# EAGLE schematic VMEMega (EAGLE 6.5.0)

## Sheet 1 of 3
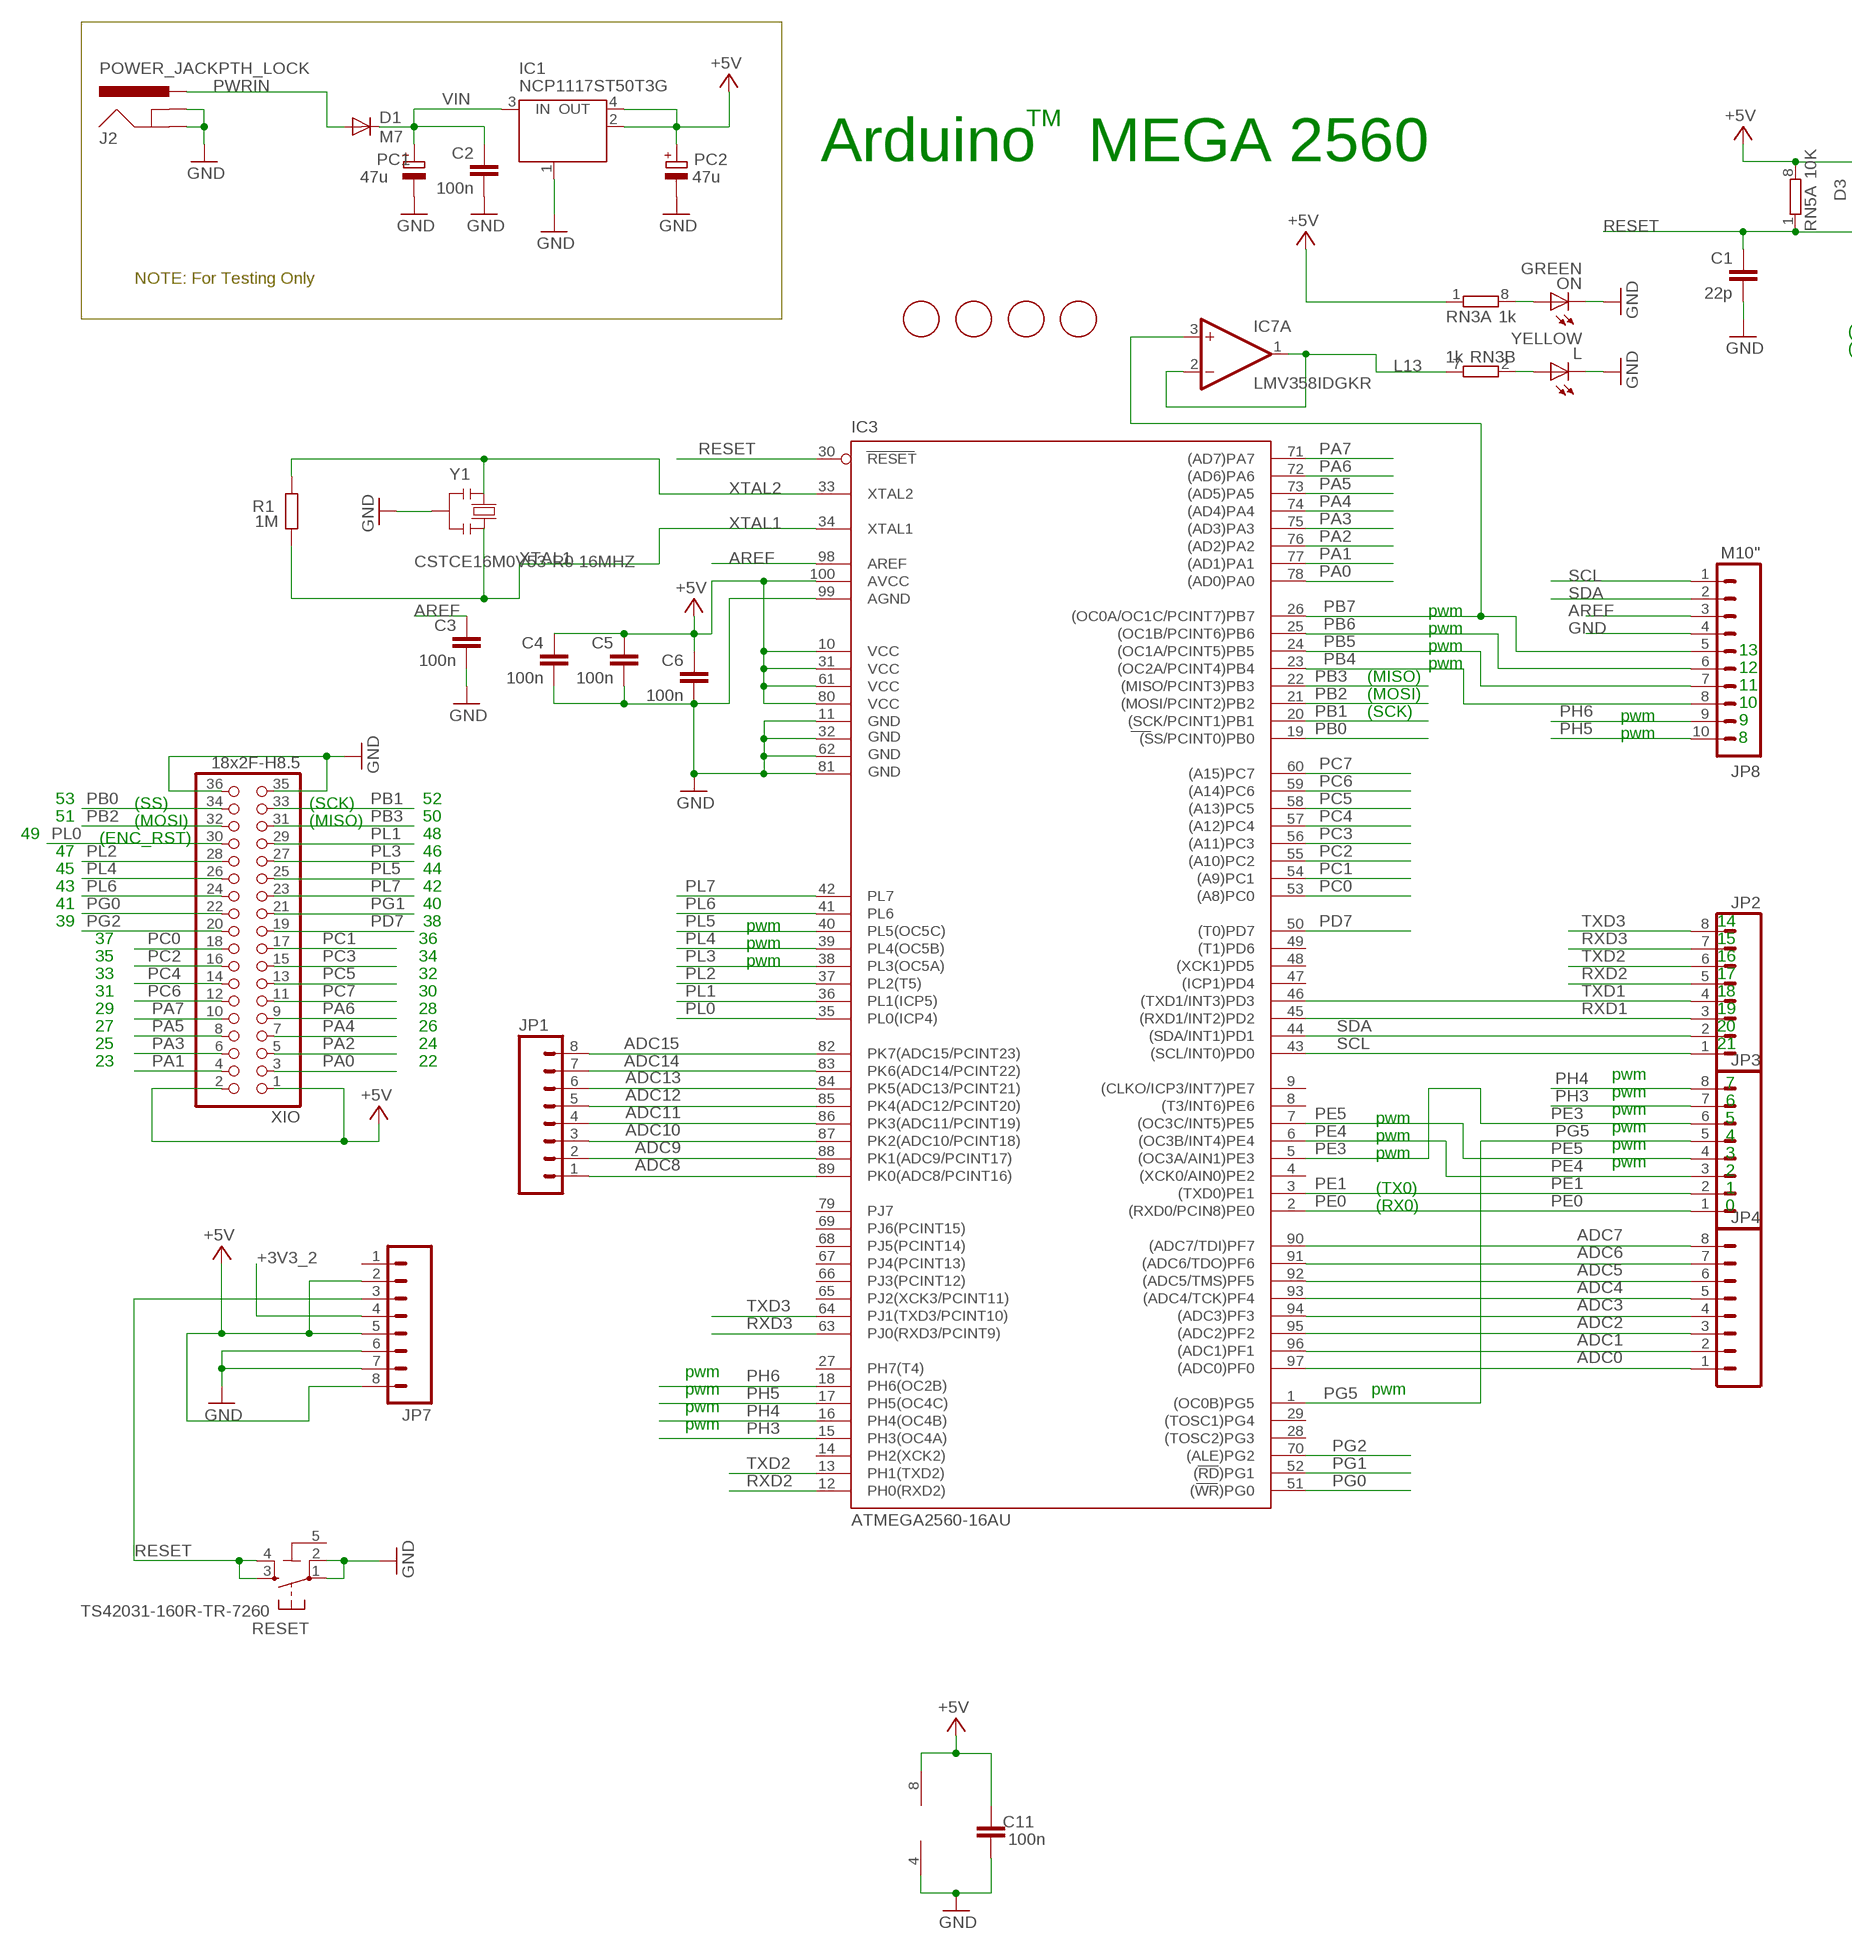
[diagram p0: schematic, sheet 1, part 1 of 2]
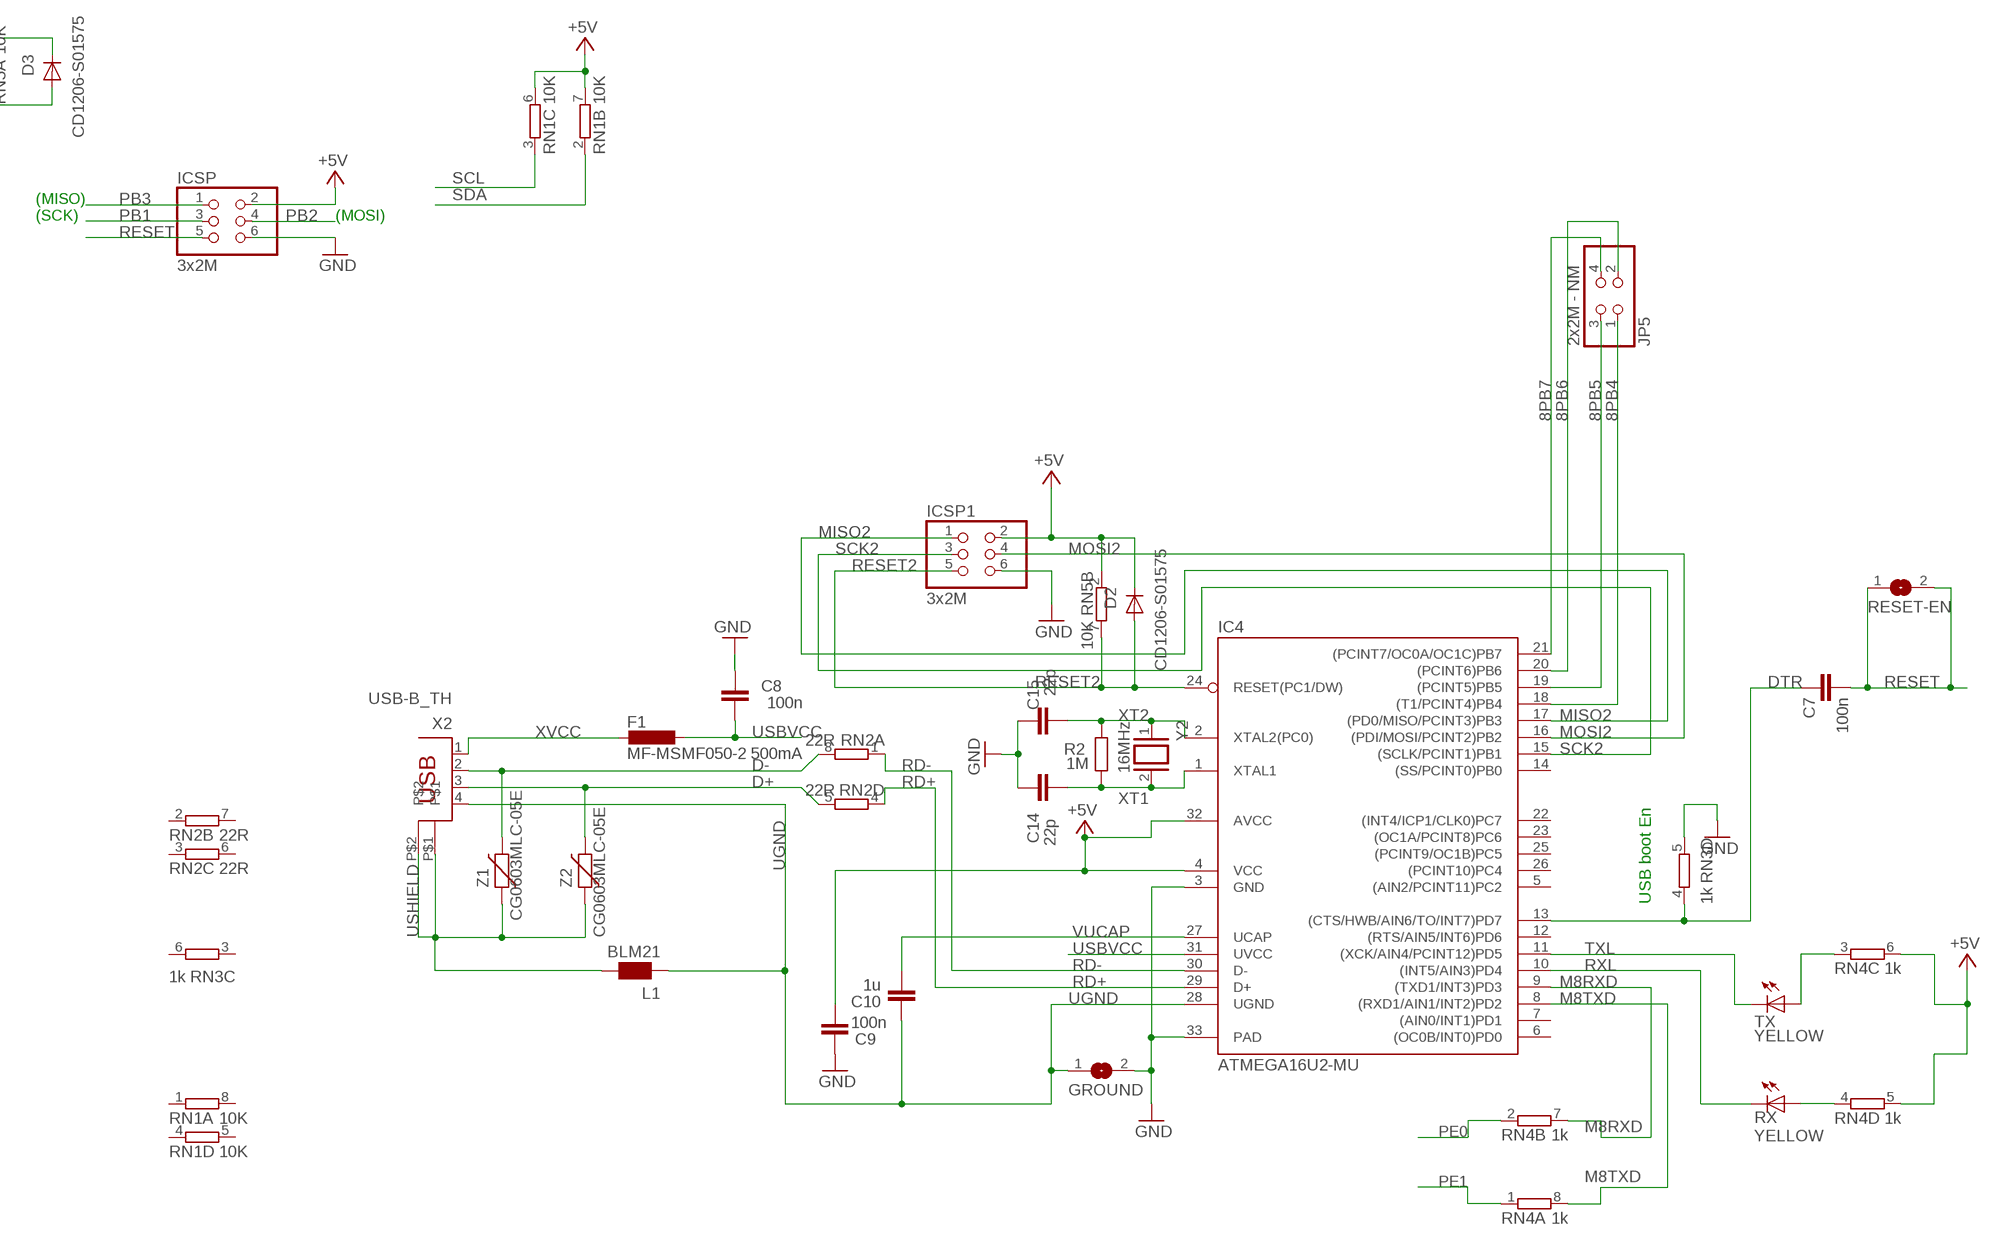
[diagram p1: schematic, sheet 1, part 2 of 2]

### Parts
C1  22p  C-EU0603-RND  [C0603-ROUND]
C2  100n  C-EU0603-RND  [C0603-ROUND]
C3  100n  C-EU0603-RND  [C0603-ROUND]
C4  100n  C-EU0603-RND  [C0603-ROUND]
C5  100n  C-EU0603-RND  [C0603-ROUND]
C6  100n  C-EU0603-RND  [C0603-ROUND]
C7  100n  C-EU0603-RND  [C0603-ROUND]
C8  100n  C-EU0603-RND  [C0603-ROUND]
C9  100n  C-EU0603-RND  [C0603-ROUND]
C10  1u  C-EU0603-RND  [C0603-ROUND]
C11  100n  C-EU0603-RND  [C0603-ROUND]
C14  22p  C-EU0603-RND  [C0603-ROUND]
C15  22p  C-EU0603-RND  [C0603-ROUND]
D1  M7  DIODE-SMB  [SMB]
D2  CD1206-S01575  DIODE-MINIMELF  [MINIMELF]
D3  CD1206-S01575  DIODE-MINIMELF  [MINIMELF]
F1  MF-MSMF050-2 500mA  L-EUL1812  [L1812]
FD1  FIDUCIALMOUNT  [FIDUCIA-MOUNT]
FD2  FIDUCIALMOUNT  [FIDUCIA-MOUNT]
FD3  FIDUCIALMOUNT  [FIDUCIA-MOUNT]
FD4  FIDUCIALMOUNT  [FIDUCIA-MOUNT]
GROUND  SJ  [SJ]
IC1  NCP1117ST50T3G  MC33269ST-3.3T3  [SOT223]
IC3  ATMEGA2560-16AU  ATMEGA25602560-16AU  [TQFP100]
IC4  ATMEGA16U2-MU  [MLF32]
IC7  LMV358IDGKR  LMV358MMX  [MSOP08]
ICSP  3x2M  PINHD-2X3  [2X03]
ICSP1  3x2M  PINHD-2X3  [2X03]
J2  POWER_JACKPTH_LOCK  [POWER_JACK_PTH_LOCK]
JP1  M081X08  [1X08]
JP2  M081X08  [1X08]
JP3  M081X08  [1X08]
JP4  M081X08  [1X08]
JP5  2x2M - NM  PINHD-2X2  [2X02]
JP7  M081X08  [1X08]
JP8  M10"  [1X10]
L  YELLOW  LEDCHIP-LED0805  [CHIP-LED0805]
L1  BLM21  WE-CBF_0805  [0805]
ON  GREEN  LEDCHIP-LED0805  [CHIP-LED0805]
PC1  47u  CPOL-EUD  [PANASONIC_D]
PC2  47u  CPOL-EUD  [PANASONIC_D]
R1  1M  R-EU_R0603  [R0603-ROUND]
R2  1M  R-EU_R0603  [R0603-ROUND]
RESET  TS42031-160R-TR-7260  TS42  [TS42]
RESET-EN  SJ  [SJ]
RN1  10K  4R-NCAT16  [CAT16]
RN2  22R  4R-NCAY16  [CAY16]
RN3  1k  4R-NCAY16  [CAY16]
RN4  1k  4R-NCAY16  [CAY16]
RN5  10K  4R-NCAT16  [CAT16]
RX  YELLOW  LEDCHIP-LED0805  [CHIP-LED0805]
TX  YELLOW  LEDCHIP-LED0805  [CHIP-LED0805]
X2  USB-B_TH  PN61729  [PN61729]
XIO  18x2F-H8.5  PINHD-2X18  [2X18]
Y1  CSTCE16M0V53-R0 16MHZ  RESONATORMU  [RESONATOR]
Y2  16MHz  XTAL/S  [QS]
Z1  CG0603MLC-05E  VARISTORCN0603  [CT/CN0603]
Z2  CG0603MLC-05E  VARISTORCN0603  [CT/CN0603]

### Nets
8PB4: IC4.18((T1/PCINT4)PB4) JP5.1
8PB5: IC4.19((PCINT5)PB5) JP5.3
8PB6: IC4.20((PCINT6)PB6) JP5.2
8PB7: IC4.21((PCINT7/OC0A/OC1C)PB7) JP5.4
+3V3_2 [power]: JP7.4 ; also sheet 2
+5V [power usb]: C4.1 C5.1 C6.1 C9.1 C11.2 D2.C D3.C IC1.2(OUT) IC1.4(OUT) IC3.10(VCC) IC3.31(VCC1) IC3.61(VCC2) IC3.80(VCC3) IC3.100(AVCC) IC4.4(VCC) IC4.32(AVCC) IC7.8(P:V+) ICSP1.2 ICSP.2 JP7.2 JP7.5 JP7.8 PC2.+ RN1.6 RN1.7 RN3.1 RN4.5 RN4.6 RN5.2 RN5.8 XIO.1 XIO.2 ; also sheet 2,3
ADC0: IC3.97((ADC0)PF0) JP4.1
ADC1: IC3.96((ADC1)PF1) JP4.2
ADC2: IC3.95((ADC2)PF2) JP4.3
ADC3: IC3.94((ADC3)PF3) JP4.4
ADC4: IC3.93((ADC4/TCK)PF4) JP4.5
ADC5: IC3.92((ADC5/TMS)PF5) JP4.6
ADC6: IC3.91((ADC6/TDO)PF6) JP4.7
ADC7: IC3.90((ADC7/TDI)PF7) JP4.8
ADC8: IC3.89(PK0(ADC8/PCINT16)) JP1.1
ADC9: IC3.88(PK1(ADC9/PCINT17)) JP1.2
ADC10: IC3.87(PK2(ADC10/PCINT18)) JP1.3
ADC11: IC3.86(PK3(ADC11/PCINT19)) JP1.4
ADC12: IC3.85(PK4(ADC12/PCINT20)) JP1.5
ADC13: IC3.84(PK5(ADC13/PCINT21)) JP1.6
ADC14: IC3.83(PK6(ADC14/PCINT22)) JP1.7
ADC15: IC3.82(PK7(ADC15/PCINT23)) JP1.8
AREF: C3.1 IC3.98(AREF) JP8.3 ; also sheet 2
D+: RN2.5 X2.3 Z2.2
D-: RN2.8 X2.2 Z1.2
DTR: C7.1 IC4.13((CTS/HWB/AIN6/TO/INT7)PD7) RN3.4
GND [gnd]: C1.2 C2.2 C3.2 C4.2 C5.2 C6.2 C8.2 C9.2 C11.1 C14.2 C15.2 GROUND.2 IC1.1(GND/ADJ) IC3.11(GND) IC3.32(GND1) IC3.62(GND2) IC3.81(GND3) IC3.99(AGND) IC4.3(GND) IC4.33(PAD) IC7.4(P:V-) ICSP1.6 ICSP.6 J2.GND J2.GNDBREAK JP7.6 JP7.7 JP8.4 L.C ON.C PC1.- PC2.- RESET.1 RESET.2 RN3.5 XIO.35 XIO.36 Y1.2 ; also sheet 2,3
L13: IC7.1(A:OUT) IC7.2(A:-IN) RN3.7
M8RXD: IC4.9((TXD1/INT3)PD3) RN4.7
M8TXD: IC4.8((RXD1/AIN1/INT2)PD2) RN4.8
MISO2: IC4.17((PD0/MISO/PCINT3)PB3) ICSP1.1
MOSI2: IC4.16((PDI/MOSI/PCINT2)PB2) ICSP1.4
N$2: L.A RN3.2
N$3: ON.A RN3.8
N$54: RN4.4 RX.A
N$55: RN4.3 TX.A
PA0: IC3.78((AD0)PA0) XIO.3
PA1: IC3.77((AD1)PA1) XIO.4
PA2: IC3.76((AD2)PA2) XIO.5
PA3: IC3.75((AD3)PA3) XIO.6
PA4: IC3.74((AD4)PA4) XIO.7
PA5: IC3.73((AD5)PA5) XIO.8
PA6: IC3.72((AD6)PA6) XIO.9
PA7: IC3.71((AD7)PA7) XIO.10
PB0: IC3.19((SS/PCINT0)PB0) XIO.34 ; also sheet 3
PB1: IC3.20((SCK/PCINT1)PB1) ICSP.3 XIO.33 ; also sheet 3
PB2: IC3.21((MOSI/PCINT2)PB2) ICSP.4 XIO.32 ; also sheet 3
PB3: IC3.22((MISO/PCINT3)PB3) ICSP.1 XIO.31 ; also sheet 3
PB4: IC3.23((OC2A/PCINT4)PB4) JP8.8
PB5: IC3.24((OC1A/PCINT5)PB5) JP8.7
PB6: IC3.25((OC1B/PCINT6)PB6) JP8.6
PB7: IC3.26((OC0A/OC1C/PCINT7)PB7) IC7.3(A:+IN) JP8.5
PC0: IC3.53((A8)PC0) XIO.18
PC1: IC3.54((A9)PC1) XIO.17
PC2: IC3.55((A10)PC2) XIO.16
PC3: IC3.56((A11)PC3) XIO.15
PC4: IC3.57((A12)PC4) XIO.14
PC5: IC3.58((A13)PC5) XIO.13
PC6: IC3.59((A14)PC6) XIO.12
PC7: IC3.60((A15)PC7) XIO.11
PD7: IC3.50((T0)PD7) XIO.19
PE0: IC3.2((RXD0/PCIN8)PE0) JP3.1 RN4.2
PE1: IC3.3((TXD0)PE1) JP3.2 RN4.1
PE3: IC3.5((OC3A/AIN1)PE3) JP3.6
PE4: IC3.6((OC3B/INT4)PE4) JP3.3
PE5: IC3.7((OC3C/INT5)PE5) JP3.4
PG0: IC3.51((WR)PG0) XIO.22
PG1: IC3.52((RD)PG1) XIO.21
PG2: IC3.70((ALE)PG2) XIO.20
PG5: IC3.1((OC0B)PG5) JP3.5
PH3: IC3.15(PH3(OC4A)) JP3.7
PH4: IC3.16(PH4(OC4B)) JP3.8
PH5: IC3.17(PH5(OC4C)) JP8.10
PH6: IC3.18(PH6(OC2B)) JP8.9
PL0: IC3.35(PL0(ICP4)) XIO.30 ; also sheet 3
PL1: IC3.36(PL1(ICP5)) XIO.29
PL2: IC3.37(PL2(T5)) XIO.28
PL3: IC3.38(PL3(OC5A)) XIO.27
PL4: IC3.39(PL4(OC5B)) XIO.26
PL5: IC3.40(PL5(OC5C)) XIO.25
PL6: IC3.41(PL6) XIO.24
PL7: IC3.42(PL7) XIO.23
PWRIN [power]: D1.A J2.PWR
RD+: IC4.29(D+) RN2.4
RD-: IC4.30(D-) RN2.1
RESET: C1.1 C7.2 D3.A IC3.30(RESET) ICSP.5 JP7.3 RESET-EN.1 RESET-EN.2 RESET.3 RESET.4 RN5.1
RESET2: D2.A IC4.24(RESET(PC1/DW)) ICSP1.5 RN5.7
RXD1: IC3.45((RXD1/INT2)PD2) JP2.3
RXD2: IC3.12(PH0(RXD2)) JP2.5
RXD3: IC3.63(PJ0(RXD3/PCINT9)) JP2.7
RXL: IC4.10((INT5/AIN3)PD4) RX.C
SCK2: IC4.15((SCLK/PCINT1)PB1) ICSP1.3
SCL: IC3.43((SCL/INT0)PD0) JP2.1 JP8.1 RN1.3 ; also sheet 2
SDA: IC3.44((SDA/INT1)PD1) JP2.2 JP8.2 RN1.2 ; also sheet 2
TXD1: IC3.46((TXD1/INT3)PD3) JP2.4
TXD2: IC3.13(PH1(TXD2)) JP2.6
TXD3: IC3.64(PJ1(TXD3/PCINT10)) JP2.8
TXL: IC4.11((XCK/AIN4/PCINT12)PD5) TX.C
UGND [gnd]: C10.2 GROUND.1 IC4.28(UGND) L1.1 X2.4
USBVCC [power usb]: C8.1 F1.1 IC4.31(UVCC)
USHIELD [gnd]: L1.2 X2.P$1 X2.P$2 Z1.1 Z2.1
VIN [power]: C2.1 D1.C IC1.3(IN) PC1.+
VUCAP: C10.1 IC4.27(UCAP)
XT1: C14.1 IC4.1(XTAL1) R2.1 Y2.2
XT2: C15.1 IC4.2(XTAL2(PC0)) R2.2 Y2.1
XTAL1: IC3.34(XTAL1) R1.1 Y1.3
XTAL2: IC3.33(XTAL2) R1.2 Y1.1
XVCC [power usb]: F1.2 X2.1
Unconnected: IC3.4((XCK0/AIN0)PE2) IC3.8((T3/INT6)PE6) IC3.9((CLKO/ICP3/INT7)PE7) IC3.14(PH2(XCK2)) IC3.27(PH7(T4)) IC3.28((TOSC2)PG3) IC3.29((TOSC1)PG4) IC3.47((ICP1)PD4) IC3.48((XCK1)PD5) IC3.49((T1)PD6) IC3.65(PJ2(XCK3/PCINT11)) IC3.66(PJ3(PCINT12)) IC3.67(PJ4(PCINT13)) IC3.68(PJ5(PCINT14)) IC3.69(PJ6(PCINT15)) IC3.79(PJ7) IC4.5((AIN2/PCINT11)PC2) IC4.6((OC0B/INT0)PD0) IC4.7((AIN0/INT1)PD1) IC4.12((RTS/AIN5/INT6)PD6) IC4.14((SS/PCINT0)PB0) IC4.22((INT4/ICP1/CLK0)PC7) IC4.23((OC1A/PCINT8)PC6) IC4.25((PCINT9/OC1B)PC5) IC4.26((PCINT10)PC4) IC7.5(B:+IN) IC7.6(B:-IN) IC7.7(B:OUT) JP7.1 RN1.1 RN1.4 RN1.5 RN1.8 RN2.2 RN2.3 RN2.6 RN2.7 RN3.3 RN3.6 RN5.3 RN5.4 RN5.5 RN5.6

### Notes on the sheet
- TM
- Arduino   MEGA 2560
- NOTE: For Testing Only
- (MISO)
- (SCK) | (MOSI)
- pwm
- pwm
- pwm | 13
- pwm | 12
- (MISO)
- 11
- (MOSI)
- 10
- (SCK) | pwm
- 9
- pwm | 8
- 53 | (SS) | (SCK) | 52
- 51 | (MOSI) | (MISO) | 50
- 49 | (ENC_RST) | 48
- 47 | 46
- 45 | 44
- 43 | 42
- 41 | 40
- 39 | 38 | pwm | 14
- 37 | 36 | pwm | 15
- 35 | 34 | pwm | 16
- 33 | 32 | 17
- 31 | 30 | 18
- 29 | 28 | 19
- 27 | 26 | 20
- 25 | 24 | 21
- 23 | 22 | USB boot En
- pwm
- 7
- pwm
- 6
- pwm
- pwm | 5
- pwm
- pwm | 4
- pwm
- pwm | 3
- pwm
- 2
- (TX0) | 1
- (RX0) | 0
- pwm
- pwm | pwm
- pwm
- pwm

## Sheet 2 of 3
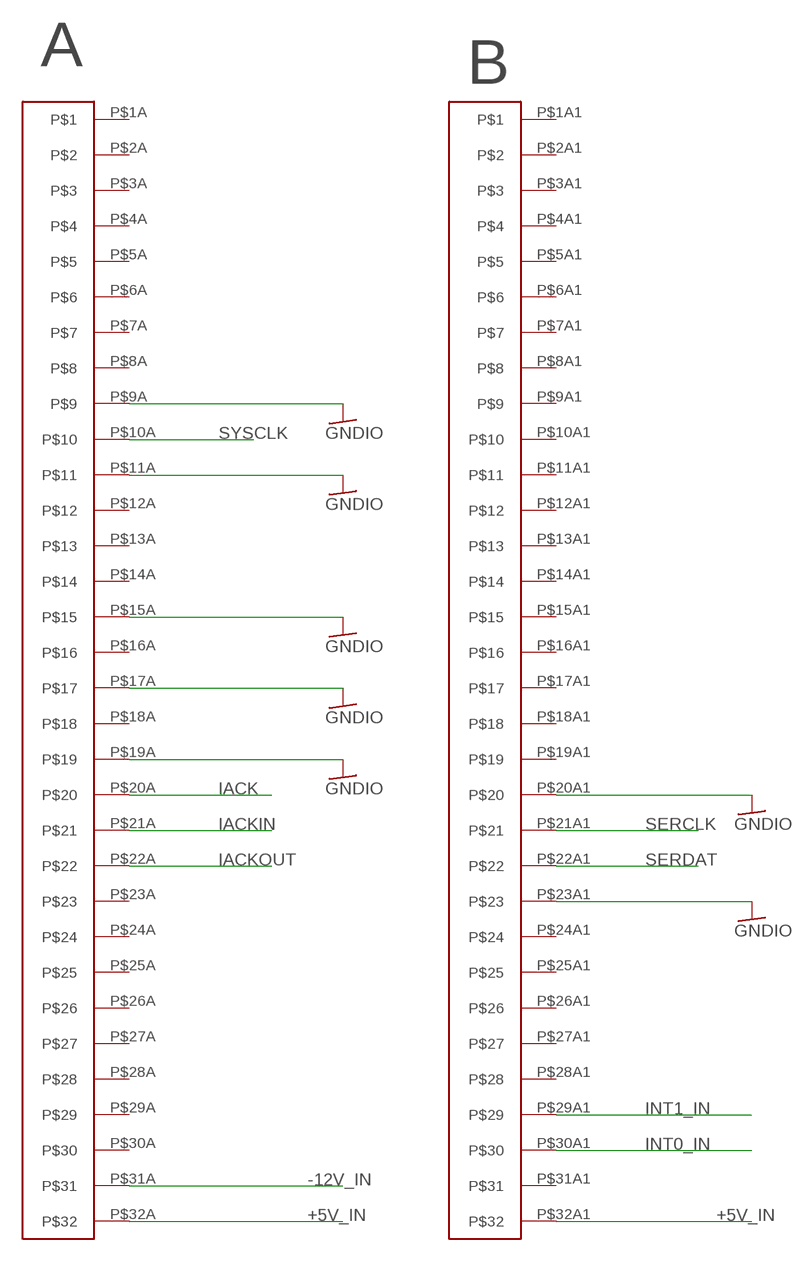
[diagram p2: schematic, sheet 2, part 1 of 2]
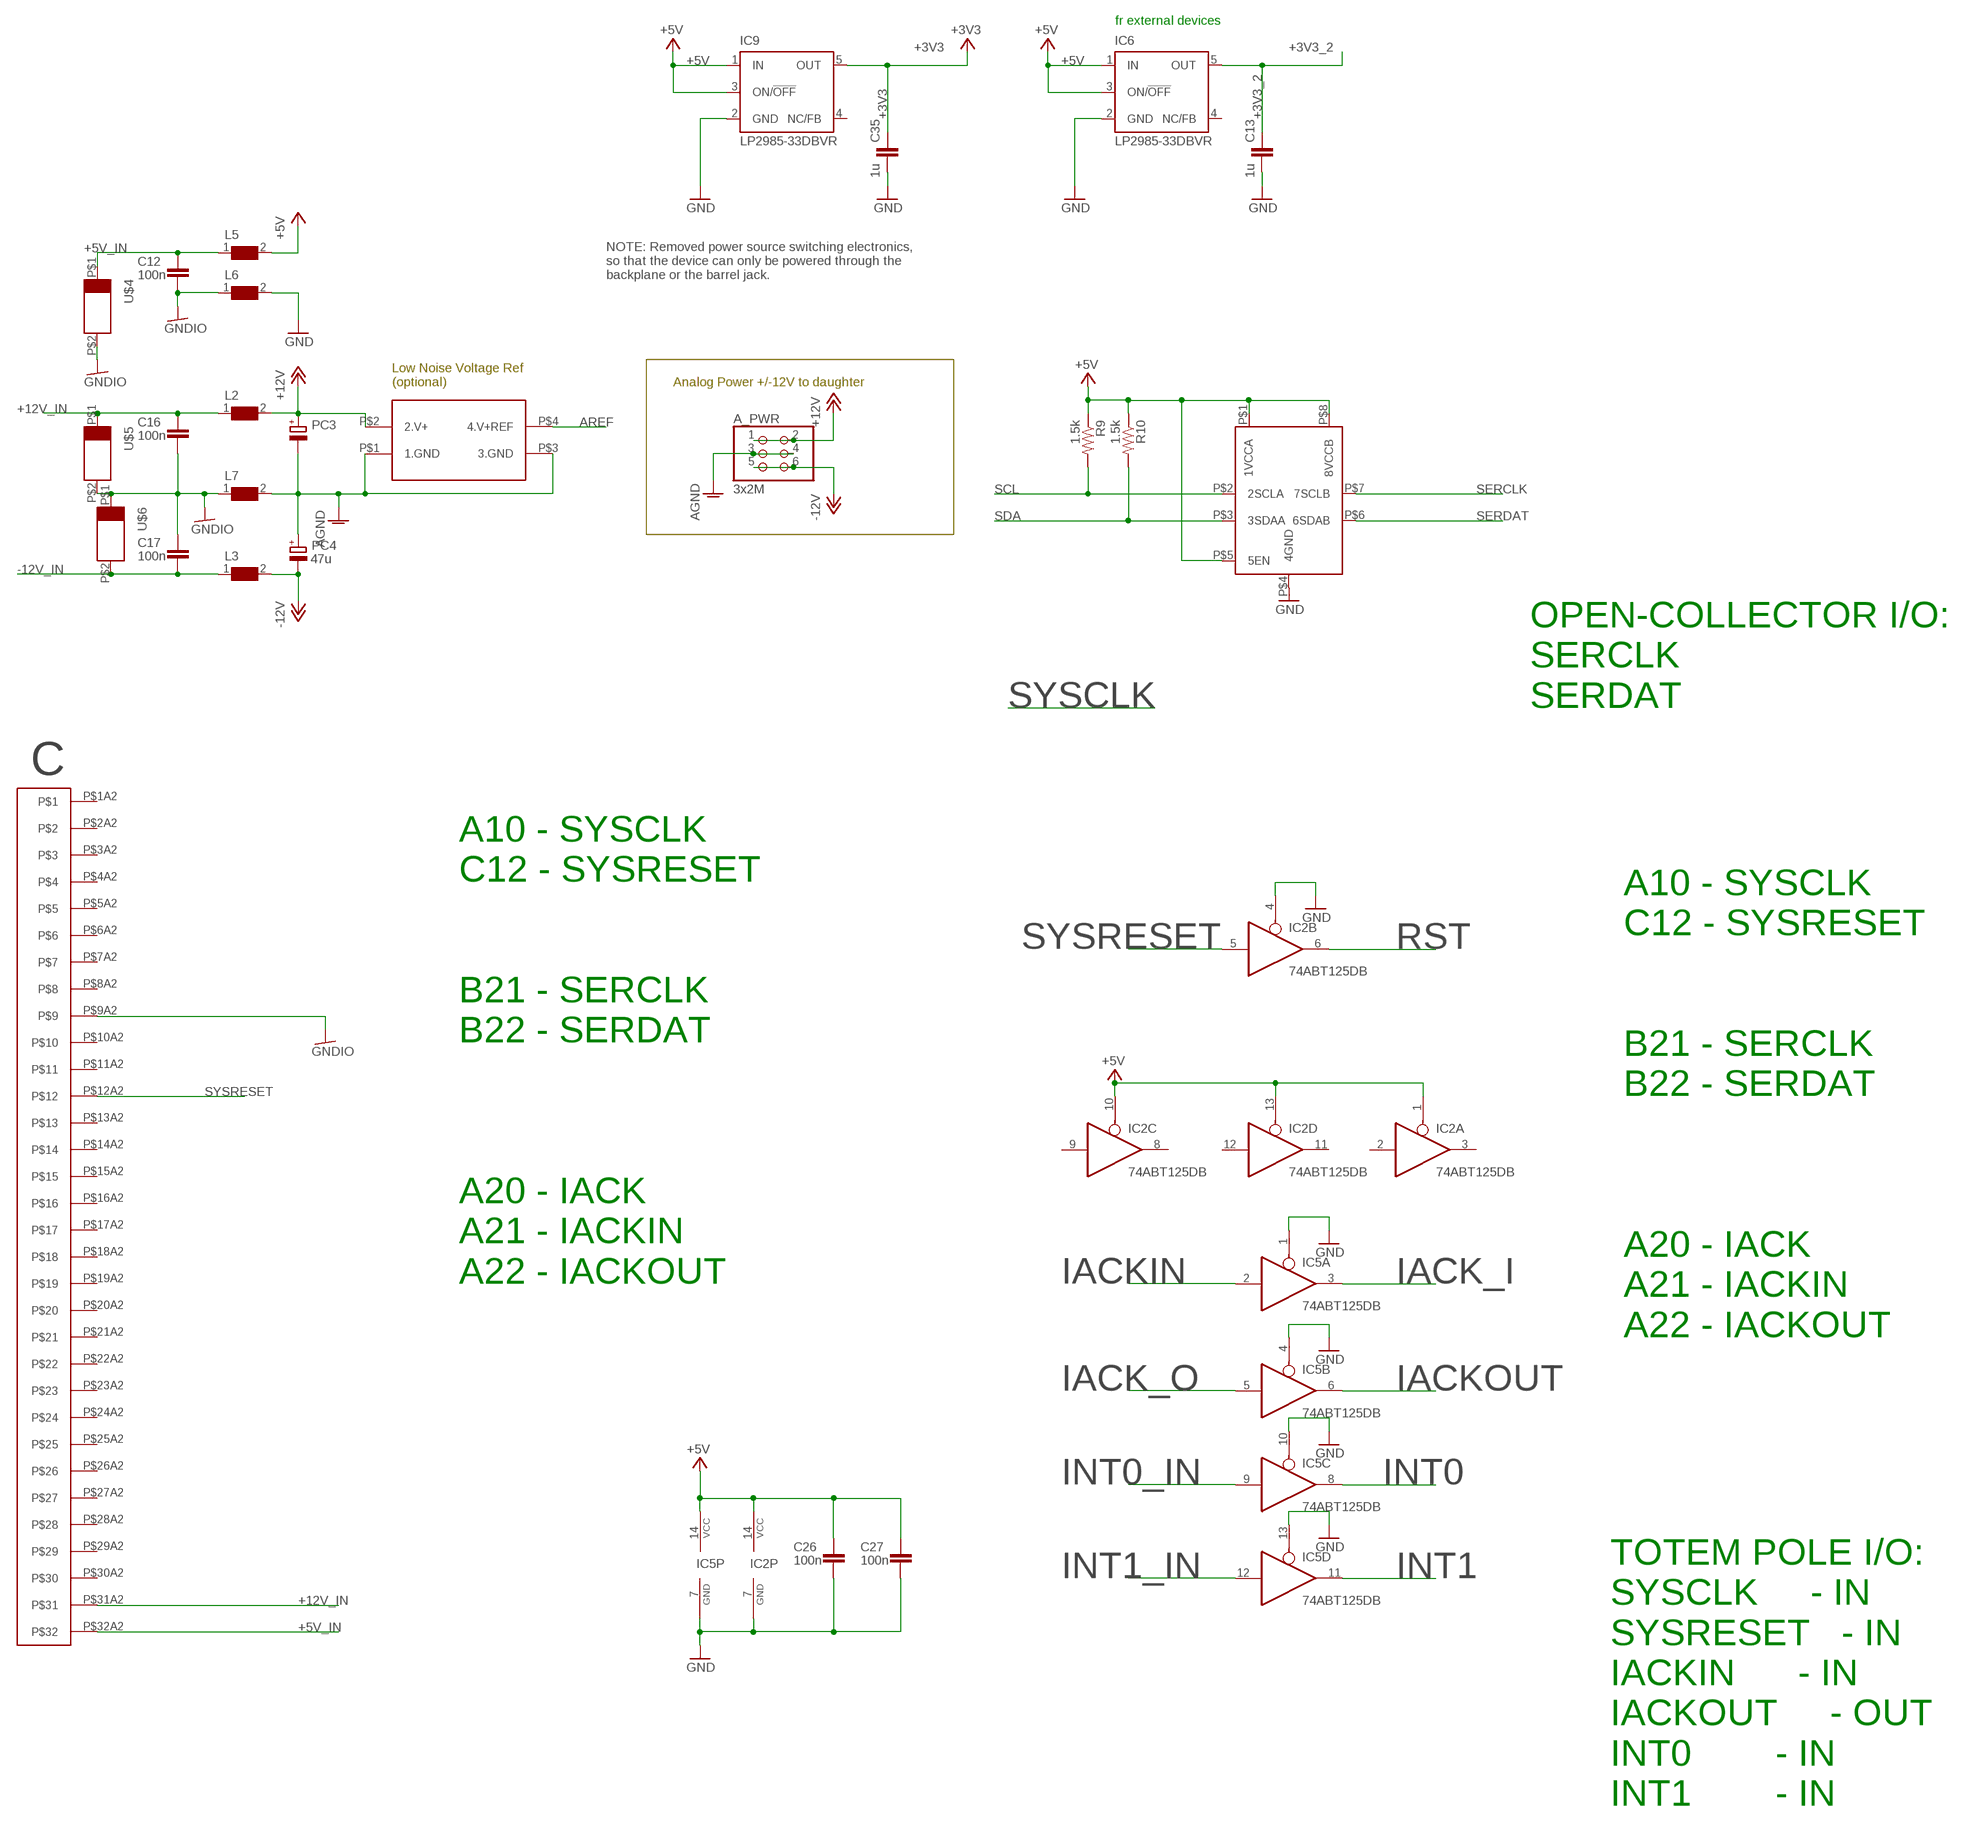
[diagram p3: schematic, sheet 2, part 2 of 2]

### Parts
A_PWR  3x2M  PINHD-2X3  [2X03]
C12  100n  C-EU0603-RND  [C0603-ROUND]
C13  1u  C-EU0603-RND  [C0603-ROUND]
C16  100n  C-EU0603-RND  [C0603-ROUND]
C17  100n  C-EU0603-RND  [C0603-ROUND]
C26  100n  C-EU0603-RND  [C0603-ROUND]
C27  100n  C-EU0603-RND  [C0603-ROUND]
C35  1u  C-EU0603-RND  [C0603-ROUND]
IC2  74ABT125DB  [SSOP14]
IC5  74ABT125DB  [SSOP14]
IC6  LP2985-33DBVR  LP2985-XXDBVR33  [SOT23-DBV]
IC9  LP2985-33DBVR  LP2985-XXDBVR33  [SOT23-DBV]
L2  WE-CBF-7427920_0805  [0805]
L3  WE-CBF-7427920_0805  [0805]
L5  WE-CBF-7427920_0805  [0805]
L6  WE-CBF-7427920_0805  [0805]
L7  WE-CBF-7427920_0805  [0805]
PC3  47u  CPOL-EUD  [PANASONIC_D]
PC4  47u  CPOL-EUD  [PANASONIC_D]
R9  1.5k  R-US_R0603  [R0603]
R10  1.5k  R-US_R0603  [R0603]
U$2  TCA9617A  [TSSOP-8]
U$3  LOWNOISE_VREF_V1B  [LOWNOISE_VREF_V1B]
U$4  SMAJ20A  [D0-214AC]
U$5  SMAJ20A  [D0-214AC]
U$6  SMAJ20A  [D0-214AC]
U$17  DIN_41612_PLUG  [DIN_41612_PLUG]

### Nets
+3V3 [power]: C35.2 IC9.5(OUT) ; also sheet 3
+3V3_2 [power]: C13.2 IC6.5(OUT) ; also sheet 1
+5V [power usb]: C26.2 C27.2 IC2.1(A:OE) IC2.10(C:OE) IC2.13(D:OE) IC2.14(P:VCC) IC5.14(P:VCC) IC6.1(IN) IC6.3(ON/!OFF) IC9.1(IN) IC9.3(ON/!OFF) L5.2 R9.1 R10.1 U$2.P$1(1VCCA) U$2.P$5(5EN) U$2.P$8(8VCCB) ; also sheet 1,3
+5V_IN: C12.2 L5.1 U$4.P$1 U$17.P$32A U$17.P$32A1 U$17.P$32A2
+12V: A_PWR.1 A_PWR.2 L2.2 PC3.+ U$3.P$2(2.V+)
+12V_IN: C16.2 L2.1 U$5.P$1 U$17.P$31A2
-12V: A_PWR.5 A_PWR.6 L3.2 PC4.-
-12V_IN: C17.1 L3.1 U$6.P$2 U$17.P$31A
AGND [gnd]: A_PWR.3 A_PWR.4 L7.2 PC3.- PC4.+ U$3.P$1(1.GND) U$3.P$3(3.GND)
AREF: U$3.P$4(4.V+REF) ; also sheet 1
GND [gnd]: C13.1 C26.1 C27.1 C35.1 IC2.4(B:OE) IC2.7(P:GND) IC5.4(B:OE) IC5.7(P:GND) IC5.10(C:OE) IC5.13(D:OE) IC6.2(GND) IC9.2(GND) L6.2 U$2.P$4(4GND) ; also sheet 1,3
GNDIO [gnd]: C12.1 C16.1 C17.2 L6.1 L7.1 U$4.P$2 U$5.P$2 U$6.P$1 U$17.P$9A U$17.P$9A2 U$17.P$11A U$17.P$15A U$17.P$17A U$17.P$19A U$17.P$20A1 U$17.P$23A1
IACK: U$17.P$20A
IACK_I: IC5.3(A:O)
IACK_O: IC5.5(B:I)
IACKIN: IC5.2(A:I) U$17.P$21A
IACKOUT: IC5.6(B:O) U$17.P$22A
INT0: IC5.8(C:O)
INT0_IN: IC5.9(C:I) U$17.P$30A1
INT1: IC5.11(D:O)
INT1_IN: IC5.12(D:I) U$17.P$29A1
RST: IC2.6(B:O)
SCL: R9.2 U$2.P$2(2SCLA) ; also sheet 1
SDA: R10.2 U$2.P$3(3SDAA) ; also sheet 1
SERCLK: U$2.P$7(7SCLB) U$17.P$21A1
SERDAT: U$2.P$6(6SDAB) U$17.P$22A1
SYSCLK: U$17.P$10A
SYSRESET: IC2.5(B:I) U$17.P$12A2
Unconnected: IC2.2(A:I) IC2.3(A:O) IC2.8(C:O) IC2.9(C:I) IC2.11(D:O) IC2.12(D:I) IC5.1(A:OE) IC6.4(NC/FB) IC9.4(NC/FB) U$17.P$1A U$17.P$1A1 U$17.P$1A2 U$17.P$2A U$17.P$2A1 U$17.P$2A2 U$17.P$3A U$17.P$3A1 U$17.P$3A2 U$17.P$4A U$17.P$4A1 U$17.P$4A2 U$17.P$5A U$17.P$5A1 U$17.P$5A2 U$17.P$6A U$17.P$6A1 U$17.P$6A2 U$17.P$7A U$17.P$7A1 U$17.P$7A2 U$17.P$8A U$17.P$8A1 U$17.P$8A2 U$17.P$9A1 U$17.P$10A1 U$17.P$10A2 U$17.P$11A1 U$17.P$11A2 U$17.P$12A U$17.P$12A1 U$17.P$13A U$17.P$13A1 U$17.P$13A2 U$17.P$14A U$17.P$14A1 U$17.P$14A2 U$17.P$15A1 U$17.P$15A2 U$17.P$16A U$17.P$16A1 U$17.P$16A2 U$17.P$17A1 U$17.P$17A2 U$17.P$18A U$17.P$18A1 U$17.P$18A2 U$17.P$19A1 U$17.P$19A2 U$17.P$20A2 U$17.P$21A2 U$17.P$22A2 U$17.P$23A U$17.P$23A2 U$17.P$24A U$17.P$24A1 U$17.P$24A2 U$17.P$25A U$17.P$25A1 U$17.P$25A2 U$17.P$26A U$17.P$26A1 U$17.P$26A2 U$17.P$27A U$17.P$27A1 U$17.P$27A2 U$17.P$28A U$17.P$28A1 U$17.P$28A2 U$17.P$29A U$17.P$29A2 U$17.P$30A U$17.P$30A2 U$17.P$31A1

### Notes on the sheet
- fr external devices
- NOTE: Removed power source switching electronics,
  so that the device can only be powered through the
  backplane or the barrel jack.
- Low Noise Voltage Ref
  (optional)
- Analog Power +/-12V to daughter
- OPEN-COLLECTOR I/O:
  SERCLK
  SERDAT
- A | B | C
- A10 - SYSCLK
  C12 - SYSRESET
- A10 - SYSCLK
  C12 - SYSRESET
- B21 - SERCLK
  B22 - SERDAT
- B21 - SERCLK
  B22 - SERDAT
- A20 - IACK
  A21 - IACKIN
  A22 - IACKOUT
- A20 - IACK
  A21 - IACKIN
  A22 - IACKOUT
- TOTEM POLE I/O:
  SYSCLK     - IN
  SYSRESET   - IN 
  IACKIN      - IN
  IACKOUT     - OUT
  INT0        - IN
  INT1        - IN

## Sheet 3 of 3
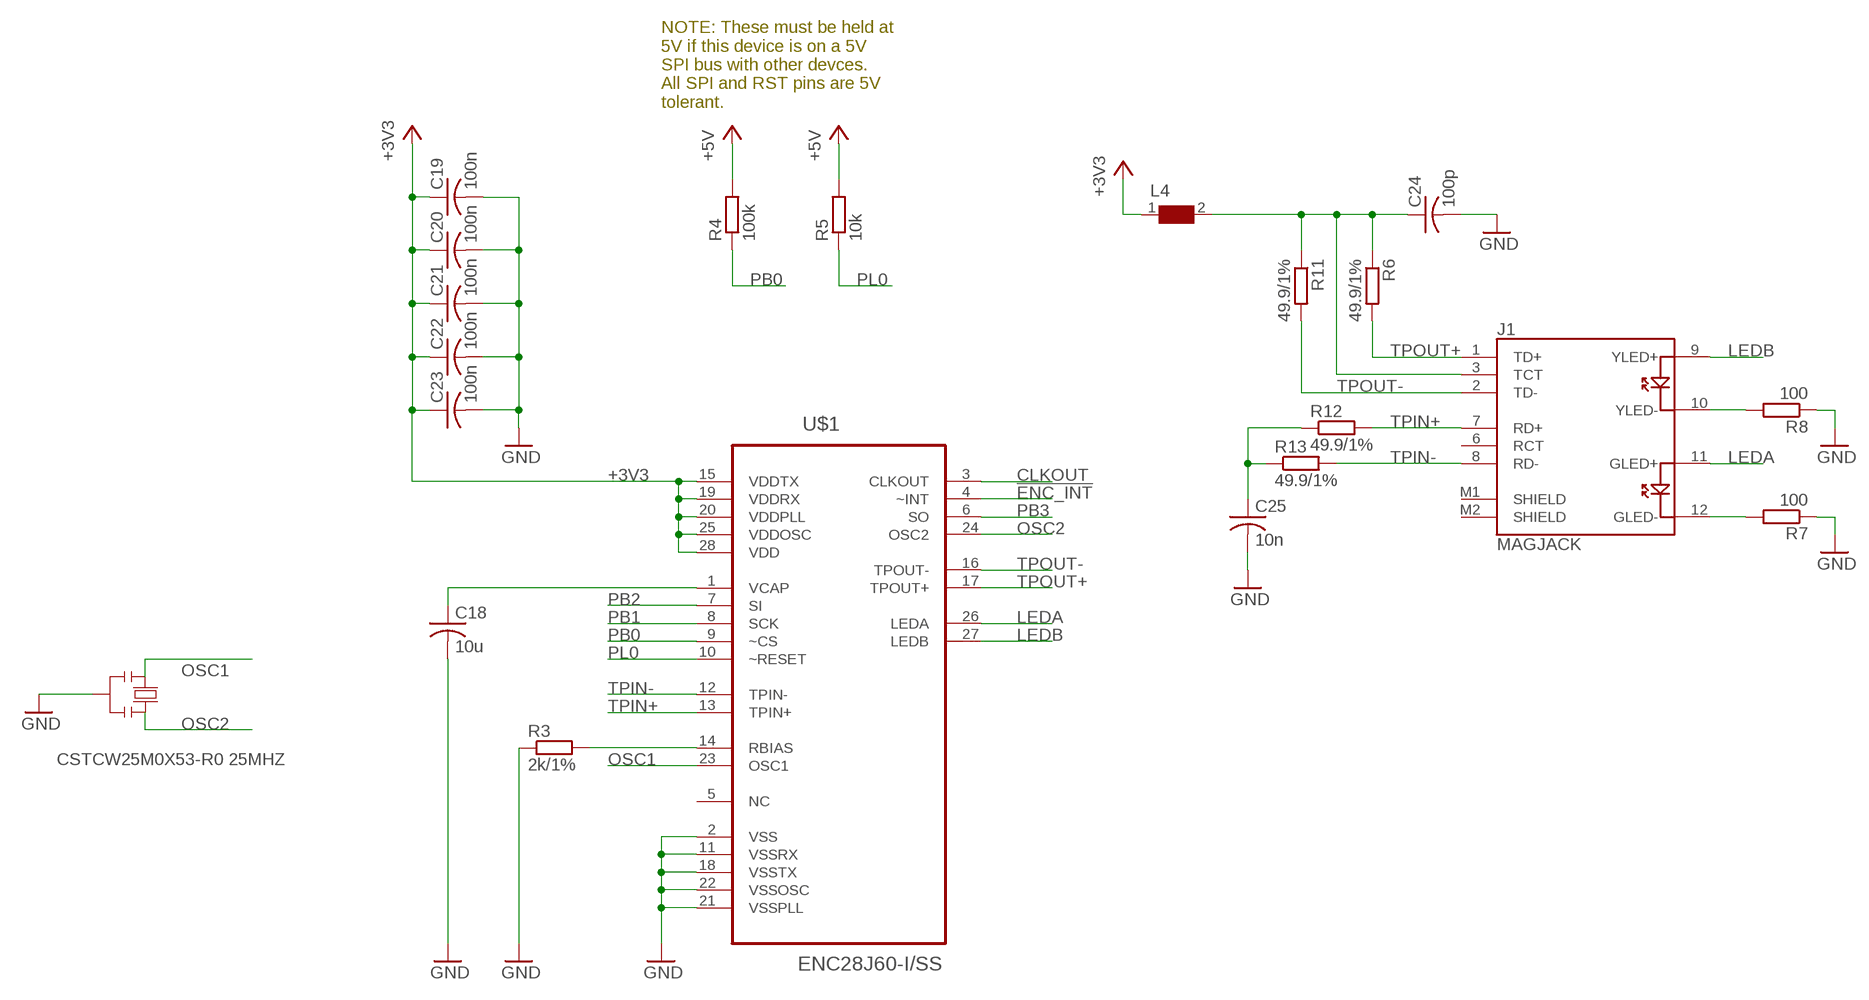
[diagram p4: schematic, sheet 3]

### Parts
C18  10u  C-USC1206  [C1206]
C19  100n  C-USC0603  [C0603]
C20  100n  C-USC0603  [C0603]
C21  100n  C-USC0603  [C0603]
C22  100n  C-USC0603  [C0603]
C23  100n  C-USC0603  [C0603]
C24  100p  C-USC0603  [C0603]
C25  10n  C-USC0603  [C0603]
J1  MAGJACK  [MAGJACK]
L4  WE-CBF-74279206_0805  [0805]
R3  2k/1%  R-EU_R0603  [R0603]
R4  100k  R-EU_R0603  [R0603]
R5  10k  R-EU_R0603  [R0603]
R6  49.9/1%  R-EU_R0603  [R0603]
R7  100  R-EU_R0603  [R0603]
R8  100  R-EU_R0603  [R0603]
R11  49.9/1%  R-EU_R0603  [R0603]
R12  49.9/1%  R-EU_R0603  [R0603]
R13  49.9/1%  R-EU_R0603  [R0603]
U$1  ENC28J60-I/SS  [SOP65P780X200-28N]
Y3  CSTCW25M0X53-R0 25MHZ  RESONATORMU  [RESONATOR]

### Nets
!ENC_INT: U$1.4(~INT)
+3V3 [power]: C19.1 C20.1 C21.1 C22.1 C23.1 L4.1 U$1.15(VDDTX) U$1.19(VDDRX) U$1.20(VDDPLL) U$1.25(VDDOSC) U$1.28(VDD) ; also sheet 2
+5V [power usb]: R4.2 R5.2 ; also sheet 1,2
CLKOUT: U$1.3(CLKOUT)
GND [gnd]: C18.2 C19.2 C20.2 C21.2 C22.2 C23.2 C24.2 C25.2 R3.1 R7.1 R8.1 U$1.2(VSS) U$1.11(VSSRX) U$1.18(VSSTX) U$1.21(VSSPLL) U$1.22(VSSOSC) Y3.2 ; also sheet 1,2
LEDA: J1.11(GLED+) U$1.26(LEDA)
LEDB: J1.9(YLED+) U$1.27(LEDB)
N$4: J1.12(GLED-) R7.2
N$5: J1.10(YLED-) R8.2
N$6: C25.1 R12.1 R13.1
N$7: C24.1 J1.3(TCT) L4.2 R6.1 R11.1
N$11: R3.2 U$1.14(RBIAS)
N$17: C18.1 U$1.1(VCAP)
OSC1: U$1.23(OSC1) Y3.1
OSC2: U$1.24(OSC2) Y3.3
PB0: R4.1 U$1.9(~CS) ; also sheet 1
PB1: U$1.8(SCK) ; also sheet 1
PB2: U$1.7(SI) ; also sheet 1
PB3: U$1.6(SO) ; also sheet 1
PL0: R5.1 U$1.10(~RESET) ; also sheet 1
TPIN+: J1.7(RD+) R12.2 U$1.13(TPIN+)
TPIN-: J1.8(RD-) R13.2 U$1.12(TPIN-)
TPOUT+: J1.1(TD+) R6.2 U$1.17(TPOUT+)
TPOUT-: J1.2(TD-) R11.2 U$1.16(TPOUT-)
Unconnected: J1.6(RCT) J1.M1(SHIELD) J1.M2(SHIELD) U$1.5(NC)

### Notes on the sheet
- NOTE: These must be held at 
  5V if this device is on a 5V 
  SPI bus with other devces.
  All SPI and RST pins are 5V
  tolerant.

## Power pins joined to a net without a drawn wire
5-GND: RESET.5(5-GND)

## Library data of the parts
A_PWR ICSP ICSP1 = SmartPrj:PINHD-2X3: PIN HEADER
C1-C17 C26 C27 C35 = SmartPrj:C-EU: CAPACITOR, European symbol
C18-C25 = rcl:C-US: CAPACITOR, American symbol
D1-D3 = diode:DIODE-: DIODE
F1 = rcl:L-EU: INDUCTOR, European symbol
FD1-FD4 = SmartPrj:FIDUCIALMOUNT
GROUND RESET-EN = jumper:SJ: SMD solder JUMPER
IC1 = linear:MC33269ST*: Adjustable Output Low Dropout Voltage Regulator 800 mA Source: http://www.onsemi.com/pub/Collateral/MC33269-D.PDF
IC2 IC5 = 74xx-us:74*125: Quad bus BUFFER, 3-state
IC3 = VMEMega:ATMEGA2560: MICROCONTROLLER 64/128/256 Kbytes FLASH 4 Kbytes EEPROM 8 Kbytes SRAM 86 General Purpose I/O pins 12-channels16-bit PWM 4 x Serial USARTs 16-channels 10-bit A/D
IC4 = SmartPrj:ATMEGA16U2-
IC6 IC9 = SmartPrj:LP2985-XXDBVR: ULTRALOW-POWER 50-mA LOW-DROPOUT LINEAR REGULATORS 50-mA Low-Dropout Regulator Source: http://focus.ti.com/lit/ds/symlink/tps77001.pdf
IC7 = linear:LMV358?*: Dual General Purpose, Low Voltage, Rail-to-Rail Output Operational Amplifiers Source: http://www.national.com/mpf/LM/LMV321.html http://www.national.com/dt/lmv_qual.pdf
J1 = SparkFun-Connectors:MAGJACK: RJ-45 with LEDs
J2 = SparkFun-Connectors:POWER_JACK: Power Jack This is the standard 5.5mm barrel jack for power. The PTH is the most common, proven, reliable, footprint. The Slot footprint only works if the mill layer is transmitted to the PCB fab house so be warned. Mating wall wart : TOL-00298 (and others); PROD_ID: PRT-00119
JP1-JP4 JP7 = SparkFun-Connectors:M08: Header 8 Standard 8-pin 0.1" header. Use with straight break away headers (SKU : PRT-00116), right angle break away headers (PRT-00553), swiss pins (PRT-00743), machine pins (PRT-00117), and female headers (PRT-00115).
JP5 = SmartPrj:PINHD-2X2: PIN HEADER
JP8 = SparkFun-Connectors:M10: Header 10 Standard 10-pin 0.1" header. Use with straight break away headers (SKU : PRT-00116), right angle break away headers (PRT-00553), swiss pins (PRT-00743), machine pins (PRT-00117), and female headers (PRT-00115).
L ON RX TX = led:LED: LED OSRAM: - CHIPLED LG R971, LG N971, LY N971, LG Q971, LY Q971, LO R971, LY R971 LH N974, LH R974 LS Q976, LO Q976, LY Q976 LO Q996 - Hyper CHIPLED LW Q18S LB Q993, LB Q99A, LB R99A - SideLED LS A670, LO A670, LY A670, LG A670, LP A670 LB A673, LV A673, LT A673, LW A673 LH A674 LY A675 LS A676, LA A676, LO A676, LY A676, LW A676 LS A679, LY A679, LG A679 - Hyper Micro SIDELED® LS Y876, LA Y876, LO Y876, LY Y876 LT Y87S - SmartLED LW L88C, LW L88S LB L89C, LB L89S, LG L890 LS L89K, LO L89K, LY L89K LS L896, LA L896, LO L896, LY L896 - TOPLED LS T670, LO T670, LY T670, LG T670, LP T670 LSG T670, LSP T670, LSY T670, LOP T670, LYG T670 LG T671, LOG T671, LSG T671 LB T673, LV T673, LT T673, LW T673 LH T674 LS T676, LA T676, LO T676, LY T676, LB T676, LH T676, LSB T676, LW T676 LB T67C, LV T67C, LT T67C, LS T67K, LO T67K, LY T67K, LW E67C LS E67B, LA E67B, LO E67B, LY E67B, LB E67C, LV E67C, LT E67C LW T67C LS T679, LY T679, LG T679 LS T770, LO T770, LY T770, LG T770, LP T770 LB T773, LV T773, LT T773, LW T773 LH T774 LS E675, LA E675, LY E675, LS T675 LS T776, LA T776, LO T776, LY T776, LB T776 LHGB T686 LT T68C, LB T68C - Hyper Mini TOPLED® LB M676 - Mini TOPLED Santana® LG M470 LS M47K, LO M47K, LY M47K Source: http://www.osram.convergy.de LUXEON: - LUMILED® LXK2-PW12-R00, LXK2-PW12-S00, LXK2-PW14-U00, LXK2-PW14-V00 LXK2-PM12-R00, LXK2-PM12-S00, LXK2-PM14-U00 LXK2-PE12-Q00, LXK2-PE12-R00, LXK2-PE12-S00, LXK2-PE14-T00, LXK2-PE14-U00 LXK2-PB12-K00, LXK2-PB12-L00, LXK2-PB12-M00, LXK2-PB14-N00, LXK2-PB14-P00, LXK2-PB14-Q00 LXK2-PR12-L00, LXK2-PR12-M00, LXK2-PR14-Q00, LXK2-PR14-R00 LXK2-PD12-Q00, LXK2-PD12-R00, LXK2-PD12-S00 LXK2-PH12-R00, LXK2-PH12-S00 LXK2-PL12-P00, LXK2-PL12-Q00, LXK2-PL12-R00 Source: www.luxeon.com KINGBRIGHT: KA-3528ASYC Source: www.kingbright.com
L1 = wuerth-elektronik:WE-CBF: SMD EMI Suppression Ferrite Beads - excellent anti-EMI properties - low DCR - impedances till 3000 ohms - rated current up to 6 A
L2 L3 L5-L7 = WE-CBF:WE-CBF: SMD EMI Suppression Ferrite Beads WE-CBF - Excellent anti-EMI properties - Low DC-restistance - Impedances till 3000 ohms - Rated current up to 6 A -- Reliable Ni-Sn electrodes -- Perfect as data lined filter and for uncoupling of distribution voltage; MPN: 7427920; OC_FARNELL: 1635707; OC_NEWARK: 08P2358; PACKAGE: IND-0805; SUPPLIER: Wuerth Elektronik
L4 = WE-CBF:WE-CBF: SMD EMI Suppression Ferrite Beads WE-CBF - Excellent anti-EMI properties - Low DC-restistance - Impedances till 3000 ohms - Rated current up to 6 A -- Reliable Ni-Sn electrodes -- Perfect as data lined filter and for uncoupling of distribution voltage; MPN: 74279206; OC_FARNELL: 1635729; OC_NEWARK: 08P2376; PACKAGE: IND-0805; SUPPLIER: Wuerth Elektronik
PC1-PC4 = rcl:CPOL-EU: POLARIZED CAPACITOR, European symbol
R1 R2 = SmartPrj:R-EU_: RESISTOR, European symbol
R3-R8 R11-R13 = rcl:R-EU_: RESISTOR, European symbol
R9 R10 = rcl:R-US_: RESISTOR, American symbol
RESET = SmartPrj:TS42: TS42 Dongnan Electronics Tact switch VDC 12V - 50mA
RN1-RN5 = resistor-dil:4R-N: Array Chip Resistor Source: RS Component / Phycomp; OC_FARNELL: unknown; OC_NEWARK: unknown
U$1 = ENC28J60:ENC28J60-I/SS: Stand-Alone Ethernet Controller; MPN: ENC28J60-I/SS; OC_FARNELL: 1084620; OC_NEWARK: 31K1708; PACKAGE: SOP-28; SUPPLIER: Microchip
U$2 = VMEMega:TCA9617A
U$3 = ebutt:LOWNOISE_VREF_V1B
U$4-U$6 = ad8512:SMAJ20A
U$17 = ebutt:DIN_41612_PLUG
X2 = SmartPrj:PN61729: BERG USB connector
XIO = SmartPrj:PINHD-2X18: PIN HEADER
Y1 Y3 = SmartPrj:RESONATOR
Y2 = SmartPrj:XTAL/S: CRYSTAL
Z1 Z2 = varistor:VARISTOR: VARISTOR

## Net classes
0 default: width 0.203 mm, drill 0.406 mm, clearance 0.203 mm
1 power: width 0.254 mm, drill 0.305 mm, clearance 0.203 mm
2 gnd: width 0.254 mm, drill 0.406 mm, clearance 0.203 mm
3 power usb: width 0.254 mm, drill 0.305 mm, clearance 0.203 mm
4 aref: width 0.406 mm, drill 0.61 mm, clearance 0.254 mm